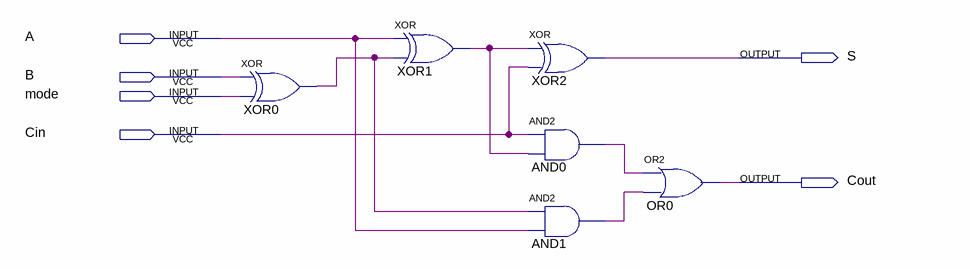
[diagram p0: schematic sheet]
// Quartus schematic fd.bdf as structural Verilog: 6 symbols, 6 pins
module fd (
  input  A,
  input  B,
  input  mode,
  input  Cin,
  output S,
  output Cout
);

  wire AND0_out, AND1_out, XOR0_out, XOR1_out;

  xor XOR0 (XOR0_out, B, mode);
  xor XOR1 (XOR1_out, A, XOR0_out);
  xor XOR2 (S, XOR1_out, Cin);
  and AND0 (AND0_out, Cin, XOR1_out);
  and AND1 (AND1_out, XOR0_out, A);
  or OR0 (Cout, AND0_out, AND1_out);
endmodule
